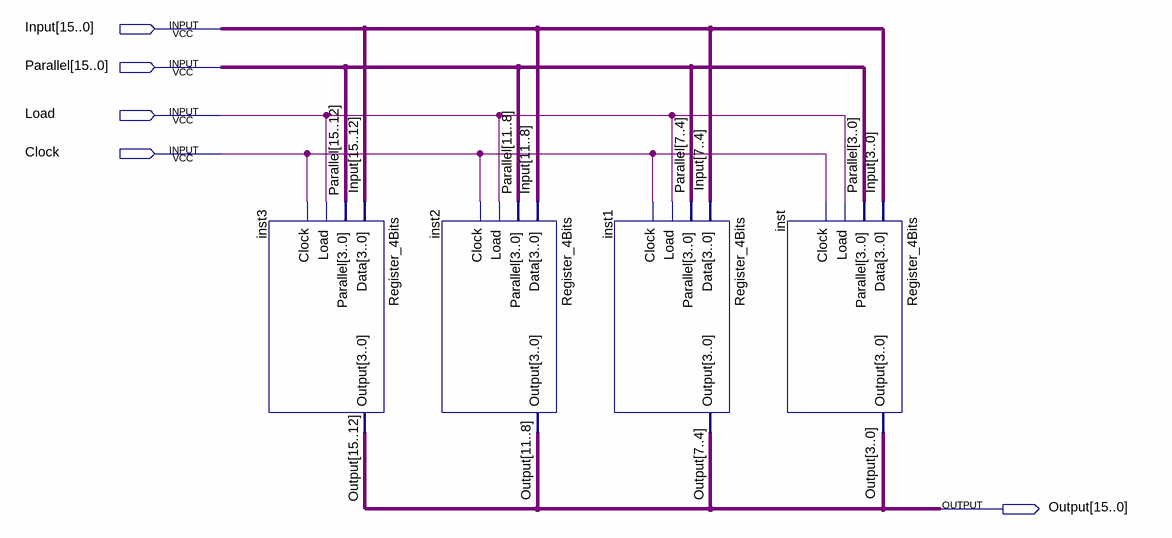
[diagram p0: schematic sheet]
// Quartus schematic Register_16Bits.bdf as structural Verilog: 4 symbols, 5 pins
module Register_16Bits (
  input  [15:0] Input,
  input  [15:0] Parallel,
  input  Load,
  input  Clock,
  output [15:0] Output
);

  Register_4Bits inst3 (
    .Data(Input[15:12]), .Parallel(Parallel[15:12]), .Load(Load), .Clock(Clock), .Output(Output[15:12]));
  Register_4Bits inst2 (
    .Data(Input[11:8]), .Parallel(Parallel[11:8]), .Load(Load), .Clock(Clock), .Output(Output[11:8]));
  Register_4Bits inst1 (.Data(Input[7:4]), .Parallel(Parallel[7:4]), .Load(Load), .Clock(Clock), .Output(Output[7:4]));
  Register_4Bits inst (.Data(Input[3:0]), .Parallel(Parallel[3:0]), .Load(Load), .Clock(Clock), .Output(Output[3:0]));
endmodule
